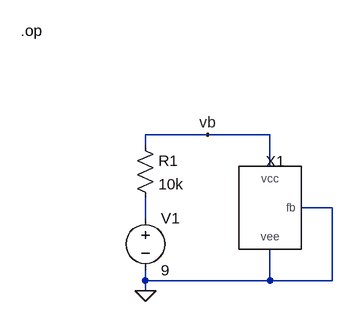
[diagram p0: schematic tb_op.asc]
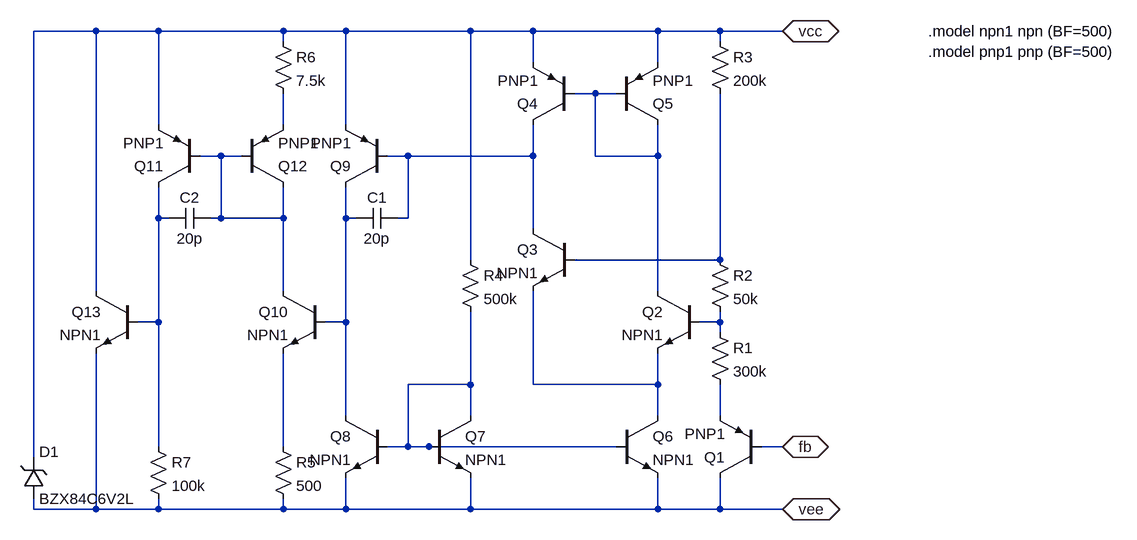
[diagram p1: sub-circuit lm185.asc]
tb_op.asc, the LTspice schematic file:
Version 4
SHEET 1 880 680
WIRE 32 64 -64 64
WIRE 128 64 32 64
WIRE -64 80 -64 64
WIRE 128 112 128 64
WIRE 224 176 176 176
WIRE -64 192 -64 160
WIRE -64 288 -64 272
WIRE 128 288 128 240
WIRE 128 288 -64 288
WIRE 224 288 224 176
WIRE 224 288 128 288
WIRE -64 304 -64 288
FLAG -64 304 0
FLAG 32 64 vb
SYMBOL LM185 128 176 R0
SYMATTR InstName X1
SYMBOL voltage -64 176 R0
WINDOW 123 0 0 Left 0
WINDOW 39 0 0 Left 0
SYMATTR InstName V1
SYMATTR Value 9
SYMBOL res -80 64 R0
SYMATTR InstName R1
SYMATTR Value 10k
TEXT -256 -96 Left 0 !.op

lm185.asc, the sub-circuit schematic file:
Version 4
SHEET 1 880 680
WIRE -800 -384 -896 -384
WIRE -704 -384 -800 -384
WIRE -512 -384 -704 -384
WIRE -416 -384 -512 -384
WIRE -224 -384 -416 -384
WIRE -128 -384 -224 -384
WIRE 64 -384 -128 -384
WIRE 160 -384 64 -384
WIRE 256 -384 160 -384
WIRE -512 -368 -512 -384
WIRE 160 -368 160 -384
WIRE -128 -336 -128 -384
WIRE 64 -336 64 -384
WIRE -32 -288 -64 -288
WIRE 0 -288 -32 -288
WIRE -704 -240 -704 -384
WIRE -512 -240 -512 -288
WIRE -416 -240 -416 -384
WIRE -608 -192 -640 -192
WIRE -576 -192 -608 -192
WIRE -320 -192 -352 -192
WIRE -128 -192 -128 -240
WIRE -128 -192 -320 -192
WIRE -32 -192 -32 -288
WIRE 64 -192 64 -240
WIRE 64 -192 -32 -192
WIRE -704 -96 -704 -144
WIRE -688 -96 -704 -96
WIRE -608 -96 -608 -192
WIRE -608 -96 -624 -96
WIRE -512 -96 -512 -144
WIRE -512 -96 -608 -96
WIRE -416 -96 -416 -144
WIRE -400 -96 -416 -96
WIRE -320 -96 -320 -192
WIRE -320 -96 -336 -96
WIRE -128 -80 -128 -192
WIRE -224 -32 -224 -384
WIRE 160 -32 160 -288
WIRE 160 -32 -64 -32
WIRE -800 16 -800 -384
WIRE -512 16 -512 -96
WIRE 64 16 64 -192
WIRE -704 64 -704 -96
WIRE -704 64 -736 64
WIRE -416 64 -416 -96
WIRE -416 64 -448 64
WIRE 160 64 160 48
WIRE 160 64 128 64
WIRE 160 80 160 64
WIRE -224 160 -224 48
WIRE -224 160 -320 160
WIRE -128 160 -128 16
WIRE 64 160 64 112
WIRE 64 160 -128 160
WIRE -416 208 -416 64
WIRE -224 208 -224 160
WIRE 64 208 64 160
WIRE 160 208 160 160
WIRE -704 256 -704 64
WIRE -512 256 -512 112
WIRE -320 256 -320 160
WIRE -320 256 -352 256
WIRE -288 256 -320 256
WIRE 0 256 -288 256
WIRE 256 256 224 256
WIRE -896 272 -896 -384
WIRE -896 352 -896 336
WIRE -800 352 -800 112
WIRE -800 352 -896 352
WIRE -704 352 -704 336
WIRE -704 352 -800 352
WIRE -512 352 -512 336
WIRE -512 352 -704 352
WIRE -416 352 -416 304
WIRE -416 352 -512 352
WIRE -224 352 -224 304
WIRE -224 352 -416 352
WIRE 64 352 64 304
WIRE 64 352 -224 352
WIRE 160 352 160 304
WIRE 160 352 64 352
WIRE 256 352 160 352
FLAG 256 -384 vcc
IOPIN 256 -384 BiDir
FLAG 256 256 fb
IOPIN 256 256 BiDir
FLAG 256 352 vee
IOPIN 256 352 BiDir
SYMBOL pnp 224 304 R180
SYMATTR InstName Q1
SYMATTR Value PNP1
SYMBOL res 144 64 R0
SYMATTR InstName R1
SYMATTR Value 300k
SYMBOL res 144 -48 R0
SYMATTR InstName R2
SYMATTR Value 50k
SYMBOL npn 128 16 M0
SYMATTR InstName Q2
SYMATTR Value NPN1
SYMBOL npn -64 -80 M0
SYMATTR InstName Q3
SYMATTR Value NPN1
SYMBOL pnp -64 -240 R180
SYMATTR InstName Q4
SYMATTR Value PNP1
SYMBOL pnp 0 -240 M180
SYMATTR InstName Q5
SYMATTR Value PNP1
SYMBOL res 144 -384 R0
SYMATTR InstName R3
SYMATTR Value 200k
SYMBOL npn 0 208 R0
SYMATTR InstName Q6
SYMATTR Value NPN1
SYMBOL res -240 -48 R0
SYMATTR InstName R4
SYMATTR Value 500k
SYMBOL npn -288 208 R0
SYMATTR InstName Q7
SYMATTR Value NPN1
SYMBOL npn -352 208 M0
SYMATTR InstName Q8
SYMATTR Value NPN1
SYMBOL pnp -352 -144 R180
SYMATTR InstName Q9
SYMATTR Value PNP1
SYMBOL cap -336 -112 R90
WINDOW 0 0 32 VBottom 0
WINDOW 3 32 32 VTop 0
SYMATTR InstName C1
SYMATTR Value 20p
SYMBOL npn -448 16 M0
SYMATTR InstName Q10
SYMATTR Value NPN1
SYMBOL res -528 240 R0
SYMATTR InstName R5
SYMATTR Value 500
SYMBOL pnp -640 -144 R180
SYMATTR InstName Q11
SYMATTR Value PNP1
SYMBOL pnp -576 -144 M180
SYMATTR InstName Q12
SYMATTR Value PNP1
SYMBOL res -528 -384 R0
SYMATTR InstName R6
SYMATTR Value 7.5k
SYMBOL cap -624 -112 R90
WINDOW 0 0 32 VBottom 0
WINDOW 3 32 32 VTop 0
SYMATTR InstName C2
SYMATTR Value 20p
SYMBOL res -720 240 R0
SYMATTR InstName R7
SYMATTR Value 100k
SYMBOL zener -912 336 M180
WINDOW 0 24 72 Left 0
WINDOW 3 24 0 Left 0
SYMATTR InstName D1
SYMATTR Value BZX84C6V2L
SYMATTR Description Diode
SYMATTR Type diode
SYMBOL npn -736 16 M0
SYMATTR InstName Q13
SYMATTR Value NPN1
TEXT 480 -384 Left 0 !.model npn1 npn (BF=500)
TEXT 480 -352 Left 0 !.model pnp1 pnp (BF=500)

The netlist it stands for:
* tb_op.asc
XX1 0 vb 0 lm185
V1 N001 0 9
R1 vb N001 10k

* block symbol definitions
.subckt lm185 fb vcc vee
Q1 vee fb N011 0 PNP1
R1 N008 N011 300k
R2 N007 N008 50k
Q2 N001 N008 N010 0 NPN1
Q3 N004 N007 N010 0 NPN1
Q4 N004 N001 vcc 0 PNP1
Q5 N001 N001 vcc 0 PNP1
R3 vcc N007 200k
Q6 N010 N009 vee 0 NPN1
R4 vcc N009 500k
Q7 N009 N009 vee 0 NPN1
Q8 N006 N009 vee 0 NPN1
Q9 N006 N004 vcc 0 PNP1
C1 N004 N006 20p
Q10 N003 N006 N012 0 NPN1
R5 N012 vee 500
Q11 N005 N003 vcc 0 PNP1
Q12 N003 N003 N002 0 PNP1
R6 vcc N002 7.5k
C2 N003 N005 20p
R7 N005 vee 100k
D1 vee vcc BZX84C6V2L
Q13 vcc N005 vee 0 NPN1
.model npn1 npn (BF=500)
.model pnp1 pnp (BF=500)
.ends lm185

.model D D
.lib standard.dio
.model NPN NPN
.model PNP PNP
.lib standard.bjt
.op
.backanno
.end